# Altium schematic sheet PWR.SchDoc
size B; SheetNumber: 2; SheetTotal: 9
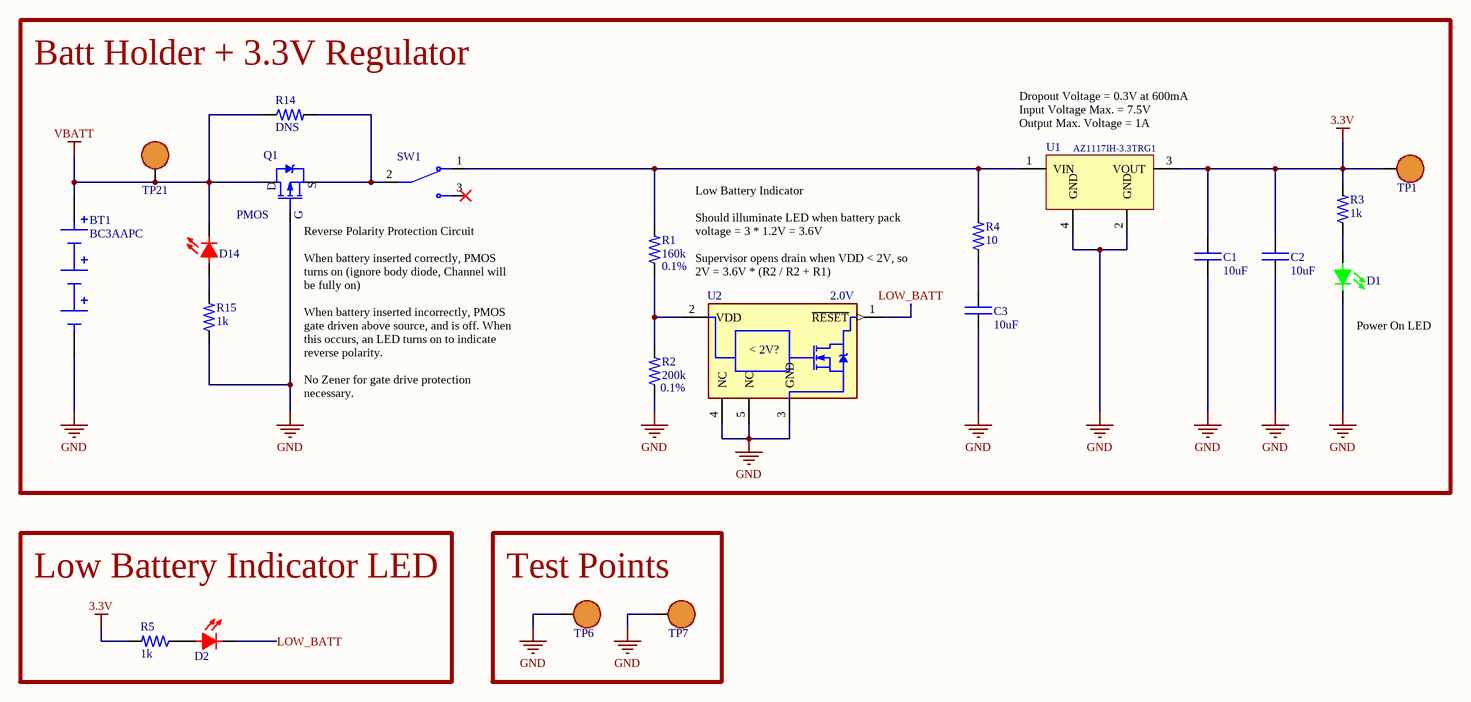
[diagram p0: PWR.SchDoc]

## Parts
BT1  BC3AAPC  [BAT_BC3AAPC]
C1  value 10uF  [0603C]  (hidden comment: CAP)
C2  value 10uF  [0603C]  (hidden comment: CAP)
C3  value 10uF  [0603C]  (hidden comment: CAP)
D1  LED - GREEN  [LED - 0603 - GREEN]  (value not drawn)
D2  LED - RED  [LED - 0603 - RED]  (value not drawn)
D14  LED - RED  [LED - 0603 - RED]  (value not drawn)
Q1  PMOS  [SOT-23]
R1  value 160k  Tolerance: 0.1%  [0402R]  (hidden comment: RES)
R2  value 200k  Tolerance: 0.1%  [0402R]  (hidden comment: RES)
R3  value 1k  [0402R]  (hidden comment: RES)
R4  value 10  [0805R]  (hidden comment: RES)
R5  value 1k  [0402R]  (hidden comment: RES)
R14  value DNS  [0805R]  (hidden comment: RES)
R15  value 1k  [0402R]  (hidden comment: RES)
SW1  SPDT TOGGLE SWITCH  [SW_100SP1T2B4M6QE]  (value not drawn)
TP1  RCWCTE  [RCWCTE]  (value not drawn)
TP6  RCWCTE  [RCWCTE]  (value not drawn)
TP7  RCWCTE  [RCWCTE]  (value not drawn)
TP21  RCWCTE  [RCWCTE]  (value not drawn)
U1  AZ1117IH-3.3TRG1  [SOT-223-3]
U2  2.0V  [SOT-23-5]

## Blocks framed on the sheet
Batt Holder + 3.3V Regulator: BT1 C1-C3 D1 D14 Q1 R1-R4 R14 R15 SW1 TP1 TP21 U1 U2
Low Battery Indicator LED: D2 R5
Test Points: TP6 TP7

## Nets
3.3V: C1.2 C2.2 R3.2 R5.2 TP1.1 U1.3(VOUT)
GND: BT1.NEG C1.1 C2.1 C3.1 D1.2(C) Q1.1(G) R2.1 R15.1 TP6.1 TP7.1 U1.2(GND) U1.4(GND) U2.3(GND) U2.4(NC) U2.5(NC)
VBATT: BT1.POS D14.2(C) Q1.3(D) R14.1 TP21.1
LOW_BATT: D2.2(C) U2.1(~{RESET})
NetC3_2: C3.2 R4.1
NetD1_1: D1.1(A) R3.1
NetD2_1: D2.1(A) R5.1
NetD14_1: D14.1(A) R15.2
NetQ1_2: Q1.2(S) R14.2 SW1.2
NetR1_1: R1.1 R2.2 U2.2(VDD)
NetR1_2: R1.2 R4.2 SW1.1 U1.1(VIN)

Not connected (* = marked no-connect by the designer): SW1 3*

## Notes on the sheet
- (near U1) Dropout Voltage = 0.3V at 600mA
  Input Voltage Max. = 7.5V
  Output Max. Voltage = 1A
- Low Battery Indicator
  Should illuminate LED when battery pack voltage = 3 * 1.2V = 3.6V
  Supervisor opens drain when VDD < 2V, so 2V = 3.6V * (R2 / R2 + R1)
- (near D1) Power On LED
- (near Q1) Reverse Polarity Protection Circuit
  When battery inserted correctly, PMOS turns on (ignore body diode, Channel will be fully on)
  When battery inserted incorrectly, PMOS gate driven above source, and is off. When this occurs, an LED turns on to indicate reverse polarity.
  No Zener for gate drive protection necessary.
- (in symbol SUPERVISOR 2V AL OD) < 2V?

## Library data of the parts
BT1 = BC3AAPC: Holder Batt 3-AA Cells Pc Mnt; MFR: MPD (Memory Protection Devices); MFR PN: BC3AAPC; Type: TH
C1-C3 = CAP: Capacitor; MFR: Samsung; MFR PN: CL10A106MQ8NNNC; Type: SMD
D1 = LED - GREEN: LED, Green, 0603; MFR: Dialight; MFR PN: 5988070107F; Type: SMD; Vf: 2V; Color: Green
D2 D14 = LED - RED: LED, Red, 0603; MFR: Würth Elektronik; MFR PN: 150060RS75000; Type: SMD; Vf: 2V; Color: Red
Q1 = PMOS: P-Channel MOSFET, 4.2A, 20V, , 52mOhm max, 1.4W; MFR: Diodes Incorporated; MFR PN: DMG2305UX-7; Type: SMD; Value: *
R1 = RES: Resistor; MFR PN: RT0402BRD07160KL; MFR: YAGEO; Type: SMD
R2 = RES: Resistor; MFR PN: RT0402BRD07200KL; MFR: YAGEO; Type: SMD
R3 R5 R15 = RES: Resistor; MFR PN: RC0402JR-071KL; MFR: YAGEO; Type: SMD
R4 = RES: Resistor; MFR PN: CRCW080510R0FKEAHP; MFR: Vishay Dale; Type: SMD
R14 = RES: Resistor; MFR PN: *; MFR: *; Type: SMD
SW1 = SPDT TOGGLE SWITCH: Toggle Switch, 100 Series, SPDT, ON-NONE-ON, Sealed, 5A, 120VAC, 28VDC, R/A PC; MFR: E-Switch; MFR PN: 100SP1T2B4M6QE; Type: TH
TP1 TP6 TP7 TP21 = TEST POINT: Test Point, Surface Mount; MFR: KOA Speer Electronics, Inc.; MFR PN: RCWCTE; Type: SMD
U1 = LIN REG 3.3V 1A: IC REG LINEAR 3.3V 1A SOT223; MFR: Texas Instruments; MFR PN: LM3940IMPX-3.3/NOPB; Type: SMD
U2 = SUPERVISOR 2V AL OD: Low-voltage supervisor with adjustable-reset time delay and manual reset; MFR PN: TLV840NADL20DBVR; MFR: Texas Instruments; Type: SMD